# EAGLE design RC Adapter 3 (EAGLE 7.5.0)
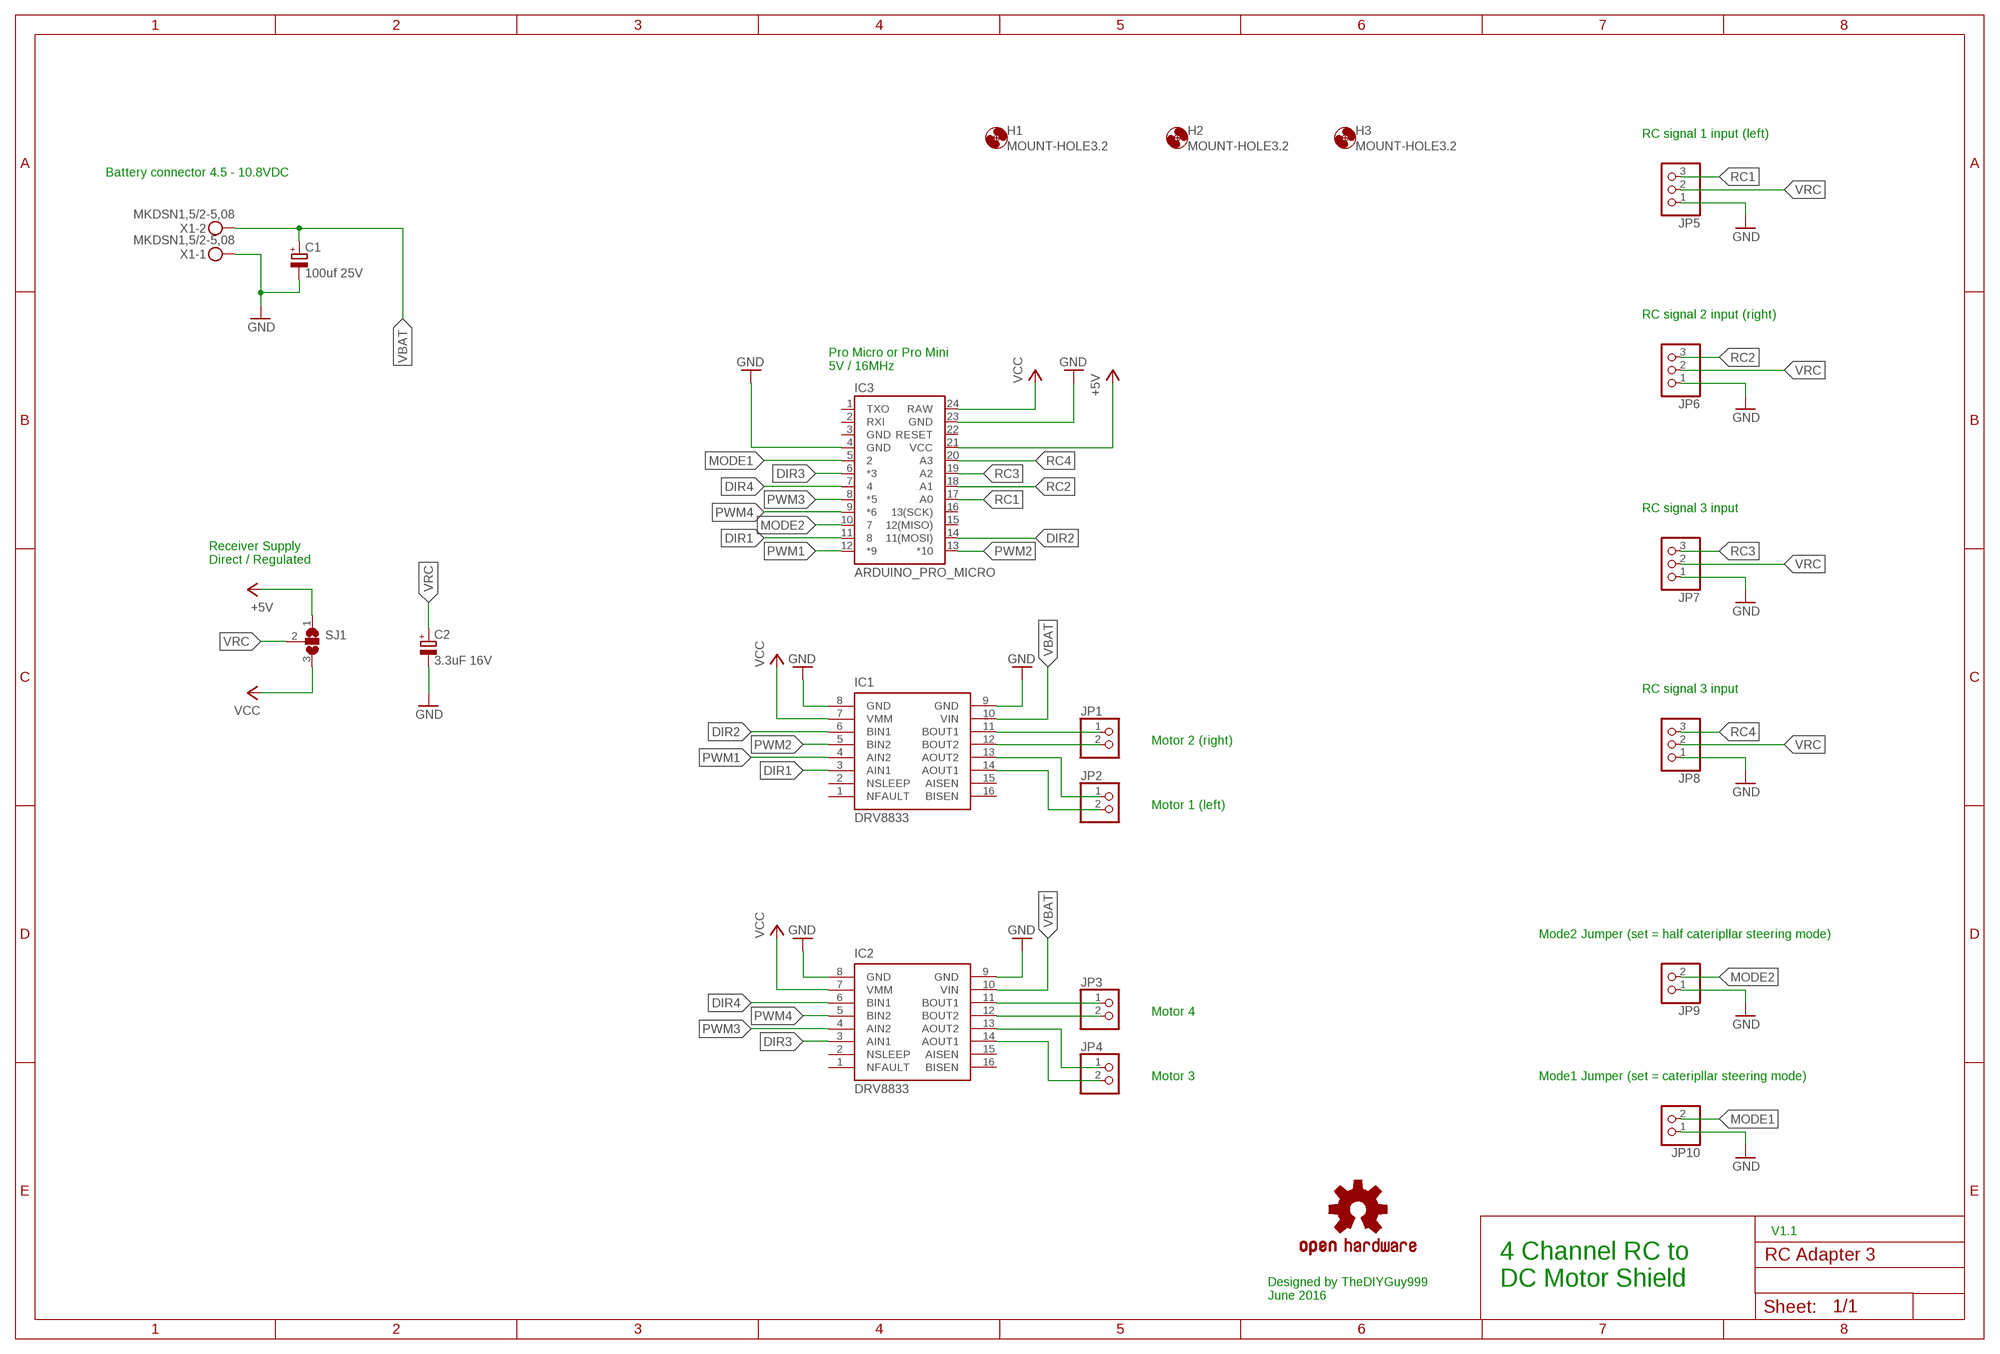
[diagram p0: schematic, sheet 1]

## Parts
C1  100uf 25V  CPOL-EUE2,5-6E  [E2,5-6E]
C2  3.3uF 16V  CPOL-EUETR1  [ETR1]
H1  MOUNT-HOLE3.2  [3,2]
H2  MOUNT-HOLE3.2  [3,2]
H3  MOUNT-HOLE3.2  [3,2]
IC1  DRV8833  [DRV8833]
IC2  DRV8833  [DRV8833]
IC3  ARDUINO_PRO_MICRO  [ARDUINO_PRO_MICRO]
JP1  PINHD-1X2  [1X02]
JP2  PINHD-1X2  [1X02]
JP3  PINHD-1X2  [1X02]
JP4  PINHD-1X2  [1X02]
JP5  PINHD-1X3  [1X03]
JP6  PINHD-1X3  [1X03]
JP7  PINHD-1X3  [1X03]
JP8  PINHD-1X3  [1X03]
JP9  PINHD-1X2  [1X02]
JP10  PINHD-1X2  [1X02]
LOGO1  OSHW-LOGOL  [OSHW-LOGO-L]
SJ1  SJ2W  [SJ_2]
X1  MKDSN1,5/2-5,08  [MKDSN1,5/2-5,08]

## Nets
+5V: IC3.21(VCC) SJ1.1
DIR1: IC1.3(AIN1) IC3.11
DIR2: IC1.6(BIN1) IC3.14(11(MOSI))
DIR3: IC2.3(AIN1) IC3.6(*3)
DIR4: IC2.6(BIN1) IC3.7
GND: C1.- C2.- IC1.8(GND) IC1.9(GND) IC2.8(GND) IC2.9(GND) IC3.4(GND) IC3.23(GND) JP5.1 JP6.1 JP7.1 JP8.1 JP9.1 JP10.1 X1.1
MODE1: IC3.5 JP10.2
MODE2: IC3.10 JP9.2
N$1: IC2.11(BOUT1) JP3.1
N$2: IC2.12(BOUT2) JP3.2
N$3: IC2.13(AOUT2) JP4.1
N$4: IC2.14(AOUT1) JP4.2
N$5: IC1.11(BOUT1) JP1.1
N$6: IC1.12(BOUT2) JP1.2
N$7: IC1.13(AOUT2) JP2.1
N$8: IC1.14(AOUT1) JP2.2
PWM1: IC1.4(AIN2) IC3.12(*9)
PWM2: IC1.5(BIN2) IC3.13(*10)
PWM3: IC2.4(AIN2) IC3.8(*5)
PWM4: IC2.5(BIN2) IC3.9(*6)
RC1: IC3.17(A0) JP5.3
RC2: IC3.18(A1) JP6.3
RC3: IC3.19(A2) JP7.3
RC4: IC3.20(A3) JP8.3
VBAT: C1.+ IC1.10(VIN) IC2.10(VIN) X1.2
VCC: IC1.7(VMM) IC2.7(VMM) IC3.24(RAW) SJ1.3
VRC: C2.+ JP5.2 JP6.2 JP7.2 JP8.2 SJ1.2
Unconnected: IC1.1(NFAULT) IC1.2(NSLEEP) IC1.15(AISEN) IC1.16(BISEN) IC2.1(NFAULT) IC2.2(NSLEEP) IC2.15(AISEN) IC2.16(BISEN) IC3.1(TXO) IC3.2(RXI) IC3.3(GND) IC3.15(12(MISO)) IC3.16(13(SCK)) IC3.22(RESET)

## Notes on the sheet
- RC signal 1 input (left)
- Battery connector 4.5 - 10.8VDC
- RC signal 2 input (right)
- Pro Micro or Pro Mini
  5V / 16MHz
- RC signal 3 input
- Receiver Supply
  Direct / Regulated
- RC signal 3 input
- Motor 2 (right)
- Motor 1 (left)
- Mode2 Jumper (set = half cateripllar steering mode)
- Motor 4
- Motor 3 | Mode1 Jumper (set = cateripllar steering mode)
- V1.1
- 4 Channel RC to
  DC Motor Shield
- Designed by TheDIYGuy999
  June 2016

## Library data of the parts
C1 C2 = rcl:CPOL-EU: POLARIZED CAPACITOR, European symbol
H1-H3 = holes:MOUNT-HOLE: MOUNTING HOLE with drill center marker
IC1 IC2 = 00_custom:DRV8833: Pololu DRV8833 DC Motor Driver Board https://www.pololu.com/product/2130
IC3 = 00_custom:ARDUINO_PRO_MICRO
JP1-JP4 JP9 JP10 = 00_custom_pinhead:PINHD-1X2: PIN HEADER
JP5-JP8 = 00_custom_pinhead:PINHD-1X3: PIN HEADER
LOGO1 = SparkFun-Aesthetics:OSHW-LOGO: Open Source Hardware Logo This logo indicates the piece of hardware it is found on incorporates a OSHW license and/or adheres to the definition of open source hardware found here: http://freedomdefined.org/OSHW
SJ1 = jumper:SJ2W: SMD solder JUMPER
X1 = con-phoenix-508:MKDSN1,5/2-5,08: MKDSN 1,5/ 2-5,08 Printklemme Nennstrom: 13,5 A Nennspannung: 250 V Rastermaß: 5,08 mm Polzahl: 2 Anschlussart: Schraubanschluss Montage: Löten Anschlussrichtung Leiter/Platine: 0 ° Artikelnummer: 1729128 Source: http://eshop.phoenixcontact.com .. 1729128.pdf

## Board
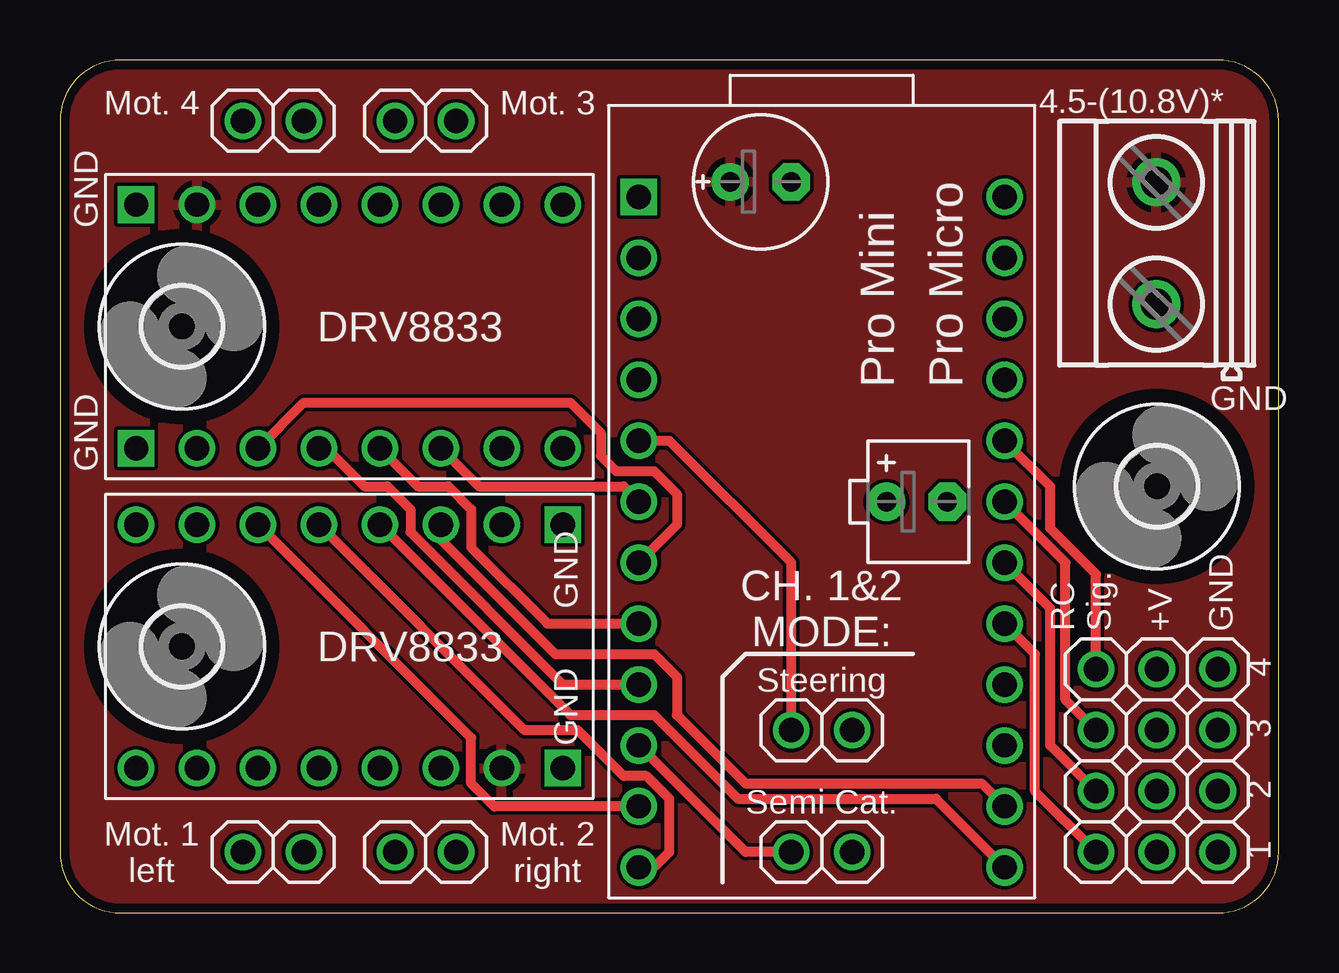
[diagram p1: board, top side]
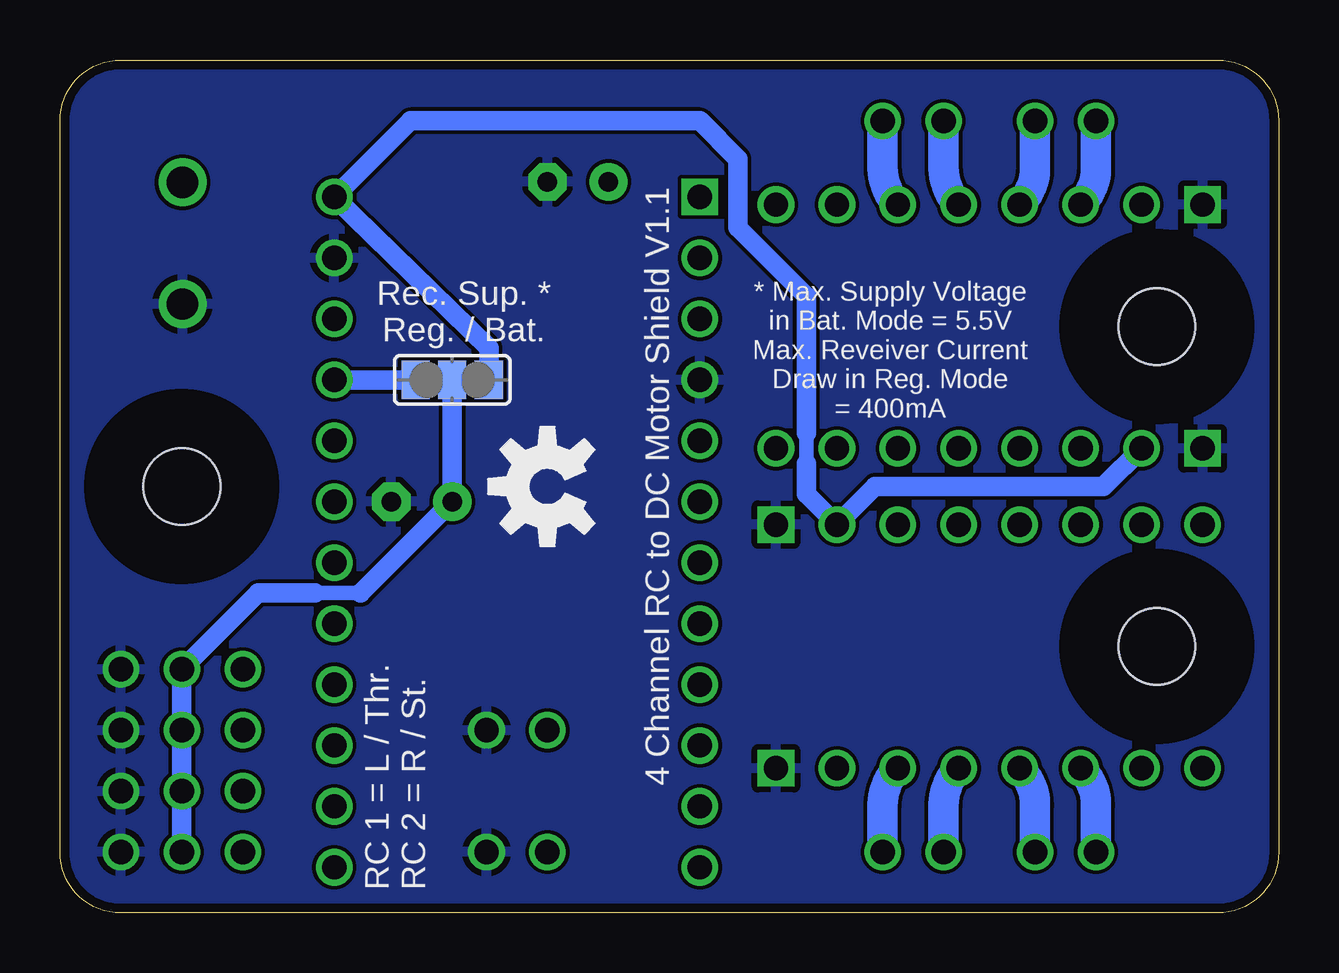
[diagram p2: board, bottom side, seen from below]

Size 50.8 x 35.56 mm. Coordinates in mm from the lower left corner, seen from the top.
Outline: 0,33.02 0,2.54 arc90 2.54,0 48.26,0 arc90 50.8,2.54 50.8,33.02 arc90 48.26,35.56 2.54,35.56 arc90 0,33.02
Copper layers (1*16): Top 0.0356mm / dielectric 1.5011mm / Bottom 0.0356mm
Design rules "OSHPark_LaenPCBOrder": minimum track width 6mil, minimum drill 13mil, track to track 6mil, track to pad 6mil, pad to pad 6mil, via to via 6mil, smd to smd 6mil, copper to edge 15mil, drill to drill 6mil, minimum pad ring 7mil, minimum via ring 7mil, stop-mask expansion 3mil, vias tented up to drill 0mil, thermal gap 10mil

### Footprints (pad centres in the part's own frame; a part is rotated, then mirrored left to right if it is on the bottom)
E2,5-6E = drill 0.813 pad 1.575: + -1.27,0 | drill 0.813 pad 1.575 octagon: - 1.27,0
ETR1 = drill 0.813 pad 1.6: + -1.27,0 | drill 0.813 pad 1.6 octagon: - 1.27,0
3,2 = hole 3.2: 0,0
DRV8833 = drill 1.016: 1 1.27,1.27; 2 1.27,3.81; 3 1.27,6.35; 4 1.27,8.89; 5 1.27,11.43; 6 1.27,13.97; 7 1.27,16.51; 10 11.43,16.51; 11 11.43,13.97; 12 11.43,11.43; 13 11.43,8.89; 14 11.43,6.35; 15 11.43,3.81; 16 11.43,1.27 | drill 1.016 square: 8 1.27,19.05; 9 11.43,19.05
ARDUINO_PRO_MICRO = drill 1.016 square: 1 -7.62,12.7 | drill 1.016: 2 -7.62,10.16; 3 -7.62,7.62; 4 -7.62,5.08; 5 -7.62,2.54; 6 -7.62,0; 7 -7.62,-2.54; 8 -7.62,-5.08; 9 -7.62,-7.62; 10 -7.62,-10.16; 11 -7.62,-12.7; 12 -7.62,-15.24; 13 7.62,-15.24; 14 7.62,-12.7; 15 7.62,-10.16; 16 7.62,-7.62; 17 7.62,-5.08; 18 7.62,-2.54; 19 7.62,0; 20 7.62,2.54; 21 7.62,5.08; 22 7.62,7.62; 23 7.62,10.16; 24 7.62,12.7
1X02 = drill 1.016: 1 -1.27,0; 2 1.27,0
1X03 = drill 1.016: 1 -2.54,0; 2 0,0; 3 2.54,0
SJ_2 = smd 1.168 x 1.6: 1 -1.524,0; 2 0,0; 3 1.524,0
MKDSN1,5/2-5,08 = drill 1.3 pad 2: 1 -2.561,0.025; 2 2.519,0.025

### Placement (x,y rotation side)
C1  29.21,30.48 0 top
C2  35.72,17.14 0 top
H1  45.72,17.78 0 top
H2  5.08,11.11 0 top
H3  5.08,24.45 0 top
IC1  1.91,17.46 270 top
IC2  22.23,18.1 90 top
IC3  31.75,17.14 0 top
JP1  15.24,2.54 180 top
JP2  8.89,2.54 180 top
JP3  8.89,33.02 0 top
JP4  15.24,33.02 0 top
JP5  45.72,2.54 180 top
JP6  45.72,5.08 180 top
JP7  45.72,7.62 180 top
JP8  45.72,10.16 180 top
JP9  31.75,2.54 180 top
JP10  31.75,7.62 180 top
LOGO1  0,-10.16 0 top  (outside the outline)
SJ1  34.45,22.23 0 bottom
U$1  [OSHW-LOGO-M]  30.48,17.78 90 bottom
X1  45.72,27.94 90 top

### Tracks (layer width: path | path; a pad name or v marks a point on that pad's centre or on a via)
+5V
  Bottom 0.813: IC3.21 SJ1.1
DIR1
  Top 0.406: IC3.11 18.1,4.45 17.14,5.4 17.14,7.3 IC1.3
DIR2
  Top 0.406: IC1.6 15.88,15.56 20.64,10.79 24.77,10.79 25.72,9.84 25.72,8.26 28.57,5.4 38.42,5.4 IC3.14
DIR3
  Top 0.406: IC2.3 17.46,17.78 23.5,17.78 IC3.6
DIR4
  Top 0.406: IC2.6 10.16,21.27 21.27,21.27 22.54,20 22.54,19.05 23.18,18.41 24.77,18.41 25.72,17.46 25.72,16.19 IC3.7
GND
  pour Bottom: -2.54,38.1 53.34,38.1 53.34,-2.54 -2.54,-2.54
MODE1
  Top 0.406: JP10.2 30.48,14.61 25.4,19.68 IC3.5
MODE2
  Top 0.406: JP9.2 28.57,2.54 IC3.10
N$1
  Bottom 1.27: JP3.1 7.62,31.06 arc45 IC2.11
N$2
  Bottom 1.27: JP3.2 10.16,31.06 arc45 IC2.12
N$3
  Bottom 1.27: JP4.1 13.97,31.06 arc-45 IC2.13
N$4
  Bottom 1.27: JP4.2 16.51,31.06 arc-45 IC2.14
N$5
  Bottom 1.27: JP1.1 16.51,4.5 arc45 IC1.11
N$6
  Bottom 1.27: JP1.2 13.97,4.5 arc45 IC1.12
N$7
  Bottom 1.27: JP2.1 10.16,4.5 arc-45 IC1.13
N$8
  Bottom 1.27: JP2.2 7.62,4.5 arc-45 IC1.14
PWM1
  Top 0.406: IC3.12 24.77,1.91 25.4,2.54 25.4,4.76 24.45,5.71 23.5,5.71 21.59,7.62 19.37,7.62 IC1.4
PWM2
  Top 0.406: IC1.5 21.27,8.26 24.77,8.26 28.26,4.76 36.51,4.76 IC3.13
PWM3
  Top 0.406: IC2.4 14.92,17.78 16.19,17.78 17.14,16.83 17.14,15.24 20.32,12.06 IC3.8
PWM4
  Top 0.406: IC2.5 11.11,19.37 12.7,17.78 13.65,17.78 14.61,16.83 14.61,15.88 20.95,9.53 IC3.9
RC1
  Top 0.406: JP5.3 40.64,5.08 40.64,10.79 IC3.17
RC2
  Top 0.406: JP6.3 41.27,6.99 41.27,12.7 IC3.18
RC3
  Top 0.406: JP7.3 41.91,8.89 41.91,14.61 IC3.19
RC4
  Top 0.406: JP8.3 43.18,14.13 41.27,16.03 41.27,17.78 IC3.20
VBAT
  pour Top: -5.08,40.64 55.88,40.64 55.88,-5.08 -5.08,-5.08
VCC
  Bottom 0.61: 19.68,18.73 19.68,20
  Bottom 0.813: IC2.7 7.3,17.78 16.83,17.78 IC1.7 19.68,17.46 19.68,18.73 | 19.68,20 19.68,25.72 22.54,28.57 22.54,31.43 24.13,33.02 36.2,33.02 IC3.24 32.92,23.56 SJ1.3
VRC
  Bottom 0.61: 38.26,13.34 40.16,13.34
  Bottom 0.813: SJ1.2 C2.+ 38.26,13.34 | 40.16,13.34 42.55,13.34 JP8.2 JP7.2 JP6.2 JP5.2

### Text on the board
tNames: Mot. 4 | Mot. 3 | 4.5-(10.8V)* | GND | Pro Mini | Pro Micro | GND | GND | GND | RC / Sig. | +V | GND | CH. 1&2 / MODE: | 4 | Steering | GND | 3 | 2 | Semi Cat. | Mot. 1 / left | Mot. 2 / right | 1
bNames: Rec. Sup. * / Reg. / Bat. | * Max. Supply Voltage / in Bat. Mode = 5.5V / Max. Reveiver Current / Draw in Reg. Mode / = 400mA | 4 Channel RC to DC Motor Shield V1.1 | RC 1 = L / Thr. / RC 2 = R / St.